# Altium project MyBoard_v1.PrjPcb
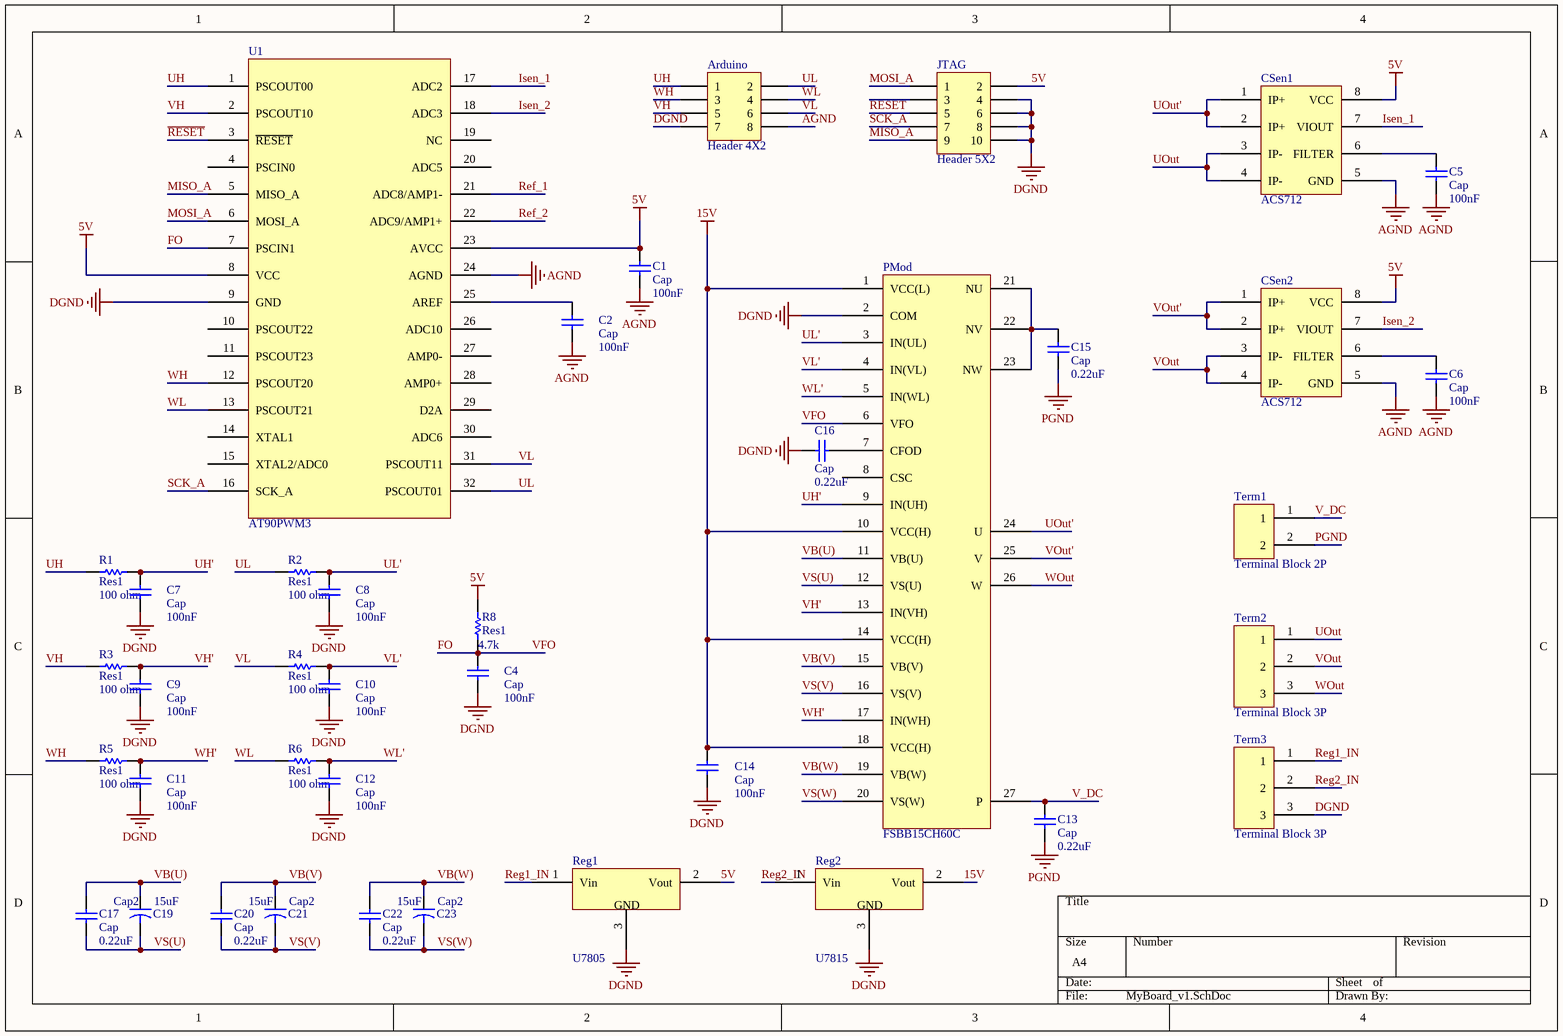
[diagram p0: MyBoard_v1.SchDoc]
1 sheet, 39 parts. Net scope: global (net labels, ports and power ports of the same name join across sheets).

## Sheet MyBoard_v1.SchDoc
size A4

### Parts
Arduino  Header 4X2  [HDR2X4]
C1  Cap  value 100nF  [NPolar_Cap]
C2  Cap  value 100nF  [NPolar_Cap]
C4  Cap  value 100nF  [NPolar_Cap]
C5  Cap  value 100nF  [NPolar_Cap]
C6  Cap  value 100nF  [NPolar_Cap]
C7  Cap  value 100nF  [NPolar_Cap]
C8  Cap  value 100nF  [NPolar_Cap]
C9  Cap  value 100nF  [NPolar_Cap]
C10  Cap  value 100nF  [NPolar_Cap]
C11  Cap  value 100nF  [NPolar_Cap]
C12  Cap  value 100nF  [NPolar_Cap]
C13  Cap  value 0.22uF  [NPolar_Cap]
C14  Cap  value 100nF  [NPolar_Cap]
C15  Cap  value 0.22uF  [NPolar_Cap]
C16  Cap  value 0.22uF  [NPolar_Cap]
C17  Cap  value 0.22uF  [NPolar_Cap]
C19  Cap2  value 15uF  [Polar_Cap]
C20  Cap  value 0.22uF  [NPolar_Cap]
C21  Cap2  value 15uF  [Polar_Cap]
C22  Cap  value 0.22uF  [NPolar_Cap]
C23  Cap2  value 15uF  [Polar_Cap]
CSen1  ACS712  [ACS712]
CSen2  ACS712  [ACS712]
JTAG  Header 5X2  [HDR2X5]
PMod  FSBB15CH60C  [FSBB20CH60F]
R1  Res1  value 100 ohm  [AXIAL-0.3]
R2  Res1  value 100 ohm  [AXIAL-0.3]
R3  Res1  value 100 ohm  [AXIAL-0.3]
R4  Res1  value 100 ohm  [AXIAL-0.3]
R5  Res1  value 100 ohm  [AXIAL-0.3]
R6  Res1  value 100 ohm  [AXIAL-0.3]
R8  Res1  value 4.7k  [AXIAL-0.3]
Reg1  U7805  [U7800]
Reg2  U7815  [U7800]
Term1  Terminal Block 2P  [Terminal Block 2 Pin]
Term2  Terminal Block 3P  [Terminal Block 3 Pin]
Term3  Terminal Block 3P  [Terminal Block 3 Pin]
U1  AT90PWM3  [AT90PWM3B]

### Nets
5V: C1.2 CSen1.8(VCC) CSen2.8(VCC) JTAG.2 R8.2 Reg1.2(Vout) U1.8(VCC) U1.23(AVCC)
15V: C14.2 PMod.1(VCC(L)) PMod.10(VCC(H)) PMod.14(VCC(H)) PMod.18(VCC(H)) Reg2.2(Vout)
AGND: Arduino.8 C1.1 C2.1 C5.1 C6.1 CSen1.5(GND) CSen2.5(GND) U1.24(AGND)
DGND: Arduino.7 C4.1 C7.1 C8.1 C9.1 C10.1 C11.1 C12.1 C14.1 C16.1 JTAG.4 JTAG.6 JTAG.8 JTAG.10 PMod.2(COM) Reg1.3(GND) Reg2.3(GND) Term3.3 U1.9(GND)
PGND: C13.1 C15.1 Term1.2
~{RESET}: JTAG.5 U1.3(~{RESET})
FO: C4.2 PMod.6(VFO) R8.1 U1.7(PSCIN1)  [also labelled VFO]
Isen_1: CSen1.7(VIOUT) U1.17(ADC2)
Isen_2: CSen2.7(VIOUT) U1.18(ADC3)
MISO_A: JTAG.9 U1.5(MISO_A)
MOSI_A: JTAG.1 U1.6(MOSI_A)
Ref_1: U1.21(ADC8/AMP1-)
Ref_2: U1.22(ADC9/AMP1+)
Reg1_IN: Reg1.1(Vin) Term3.1
Reg2_IN: Reg2.1(Vin) Term3.2
SCK_A: JTAG.7 U1.16(SCK_A)
UH: Arduino.1 R1.1 U1.1(PSCOUT00)
UH': C7.2 PMod.9(IN(UH)) R1.2
UL: Arduino.2 R2.1 U1.32(PSCOUT01)
UL': C8.2 PMod.3(IN(UL)) R2.2
UOut: CSen1.3(IP-) CSen1.4(IP-) Term2.1
UOut': CSen1.1(IP+) CSen1.2(IP+) PMod.24(U)
V_DC: C13.2 PMod.27(P) Term1.1
VB(U): C17.2 C19.1 PMod.11(VB(U))
VB(V): C20.2 C21.1 PMod.15(VB(V))
VB(W): C22.2 C23.1 PMod.19(VB(W))
VH: Arduino.5 R3.1 U1.2(PSCOUT10)
VH': C9.2 PMod.13(IN(VH)) R3.2
VL: Arduino.6 R4.1 U1.31(PSCOUT11)
VL': C10.2 PMod.4(IN(VL)) R4.2
VOut: CSen2.3(IP-) CSen2.4(IP-) Term2.2
VOut': CSen2.1(IP+) CSen2.2(IP+) PMod.25(V)
VS(U): C17.1 C19.2 PMod.12(VS(U))
VS(V): C20.1 C21.2 PMod.16(VS(V))
VS(W): C22.1 C23.2 PMod.20(VS(W))
WH: Arduino.3 R5.1 U1.12(PSCOUT20)
WH': C11.2 PMod.17(IN(WH)) R5.2
WL: Arduino.4 R6.1 U1.13(PSCOUT21)
WL': C12.2 PMod.5(IN(WL)) R6.2
WOut: PMod.26(W) Term2.3
NetC2_2: C2.2 U1.25(AREF)
NetC5_2: C5.2 CSen1.6(FILTER)
NetC6_2: C6.2 CSen2.6(FILTER)
NetC15_2: C15.2 PMod.21(NU) PMod.22(NV) PMod.23(NW)
NetC16_2: C16.2 PMod.7(CFOD)

Not connected (* = marked no-connect by the designer): JTAG 3; PMod 8(CSC); U1 4(PSCIN0) 10(PSCOUT22) 11(PSCOUT23) 14(XTAL1) 15(XTAL2/ADC0) 19(NC) 20(ADC5) 26(ADC10) 27(AMP0-) 28(AMP0+) 29(D2A) 30(ADC6)

### Library data of the parts
Arduino = Header 4X2: Header, 4-Pin, Dual row; LatestRevisionDate: 17-Jul-2002; LatestRevisionNote: Re-released for DXP Platform.; Publisher: Altium Limited
C1 C2 C4-C17 C20 C22 = Cap: Capacitor; Published: 8-Jun-2000; LatestRevisionDate: 17-Jul-2002; LatestRevisionNote: Re-released for DXP Platform.; PackageReference: RAD-0.3; Publisher: Altium Limited
C19 C21 C23 = Cap2: Capacitor; Published: 23-Sep-2002; PackageReference: CAPR5-4X5; Publisher: Altium Limited
CSen1 CSen2 = ACS711
JTAG = Header 5X2: Header, 5-Pin, Dual row; LatestRevisionDate: 17-Jul-2002; LatestRevisionNote: Re-released for DXP Platform.; Publisher: Altium Limited
R1-R6 R8 = Res1: Resistor; Published: 8-Jun-2000; LatestRevisionDate: 17-Jul-2002; LatestRevisionNote: Re-released for DXP Platform.; PackageReference: AXIAL-0.3; Publisher: Altium Limited
Reg1 Reg2 = U7800